# Altium schematic sheet LM2596_Sheet1.SchDoc
size A4; SheetNumber: 8; SheetTotal: 11
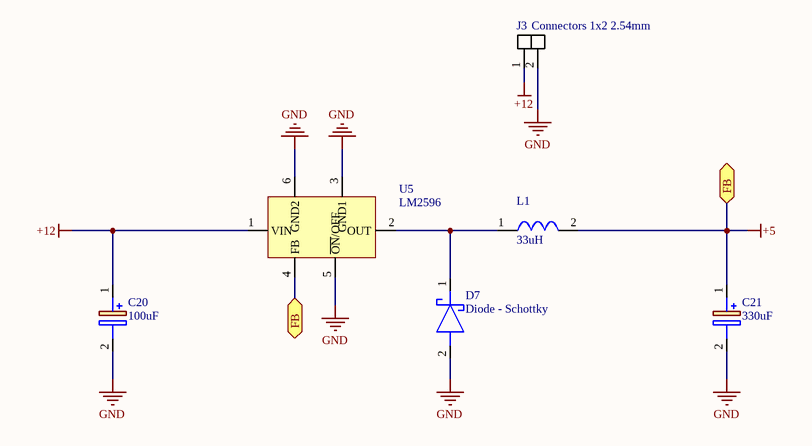
[diagram p0: LM2596_Sheet1.SchDoc]

## Parts
C20  100uF  [CAPP_Lytic_D_6.6]
C21  330uF  [CAPP_Lytic_D_6.6]
D7  Diode - Schottky  [DO214AB (SMC)]
J3  Connectors 1x2 2.54mm  [Connectors 1x2 2.54mm]
L1  33uH  [INDUCTOR  - 12X12 SMD]
U5  LM2596  [TO263-5 (D2PAK-5) - LM2596R-5.0-HTC]

## Ports
FB (bidir)

## Nets
+5: C21.1(+) L1.2 U5.4(FB) ; port FB
+12: C20.1(+) J3.1 U5.1(VIN)
GND: C20.2(-) C21.2(-) D7.2(A) J3.2 U5.3(GND1) U5.5(~{ON}/OFF) U5.6(GND2)
NetD7_1: D7.1(K) L1.1 U5.2(OUT)

## Library data of the parts
C20 C21 = Cap - Pol: Capacitor Polarised; ComponentLink1Description: Satın Alma Linki; ComponentLink1URL: https://ozdisan.com/pasif-komponentler/kondansatorler/aluminyum-kondansatorler/BDS35VC220MH10TP; ComponentLink2Description: Satın Alma Linki; ComponentLink2URL: https://ozdisan.com/pasif-komponentler/kondansatorler/aluminyum-kondansatorler/SC1H226M6L005VR; ComponentLink3Description: Satın Alma Linki; ComponentLink3URL: https://ozdisan.com/pasif-komponentler/kondansatorler/aluminyum-kondansatorler/BDA50VC10MF55TP; ComponentLink4Description: Datasheet; ComponentLink4URL: https://cdn.ozdisan.com/ETicaret_Dosya/455406_6857235.pdf
D7 = Diode - Schottky: Schottky Diode; ComponentLink1Description: Satın Alma Linki; ComponentLink1URL: https://ozdisan.com/guc-yari-iletkenleri/diyotlar-modul-diyotlar-ve-dogrultucular/schottky-diyotlar/SK56-HT; ComponentLink2Description: Datasheet; ComponentLink2URL: https://cdn.ozdisan.com/ETicaret_Dosya/475561_8333135.pdf
J3 = Connectors 1x2 2.54mm: 2 Pin (1x2) 2.54mm Erkek Pin Header THT; ComponentLink1Description: Satın Alma Linki; ComponentLink1URL: https://www.direnc.net/2-pin-1x2-254mm-erkek-pin-header-tht; ComponentLink2Description: Datasheet; ComponentLink2URL: https://pdf.direnc.net/upload/2-pin-1x2-254mm-erkek-pin-header-tht-datasheet.pdf
L1 = INDUCTOR 33uH: SRI1204-330M - INDUCTOR POWER 33UH 12X12X5MM SMD; ComponentLink1Description: Datasheet; ComponentLink1URL: https://cdn.ozdisan.com/ETicaret_Dosya/501799_1085379.pdf; ComponentLink2Description: Satın Alma Linki; ComponentLink2URL: https://ozdisan.com/pasif-komponentler/induktorler/sabit-induktorler/SRI1204-330M
U5 = LM2596: LM2596R-5.0-HTC - IC-2596 V.REG.3A 5V STEP-DOWN TO-263-5L; ComponentLink1Description: Datasheet; ComponentLink1URL: https://cdn.ozdisan.com/ETicaret_Dosya/587696_4979854.pdf; ComponentLink2Description: Satın Alma Linki; ComponentLink2URL: https://ozdisan.com/entegre-devreler-ics/guc-entegreleri/dc-dc-voltaj-regulatorleri/LM2596R-5-0-HTC